# Altium schematic sheet Gate_Driver.SchDoc
size A4; CompanyName: I-MTEC; DrawnBy: R.R.Sorial; SheetNumber: 3; SheetTotal: 5
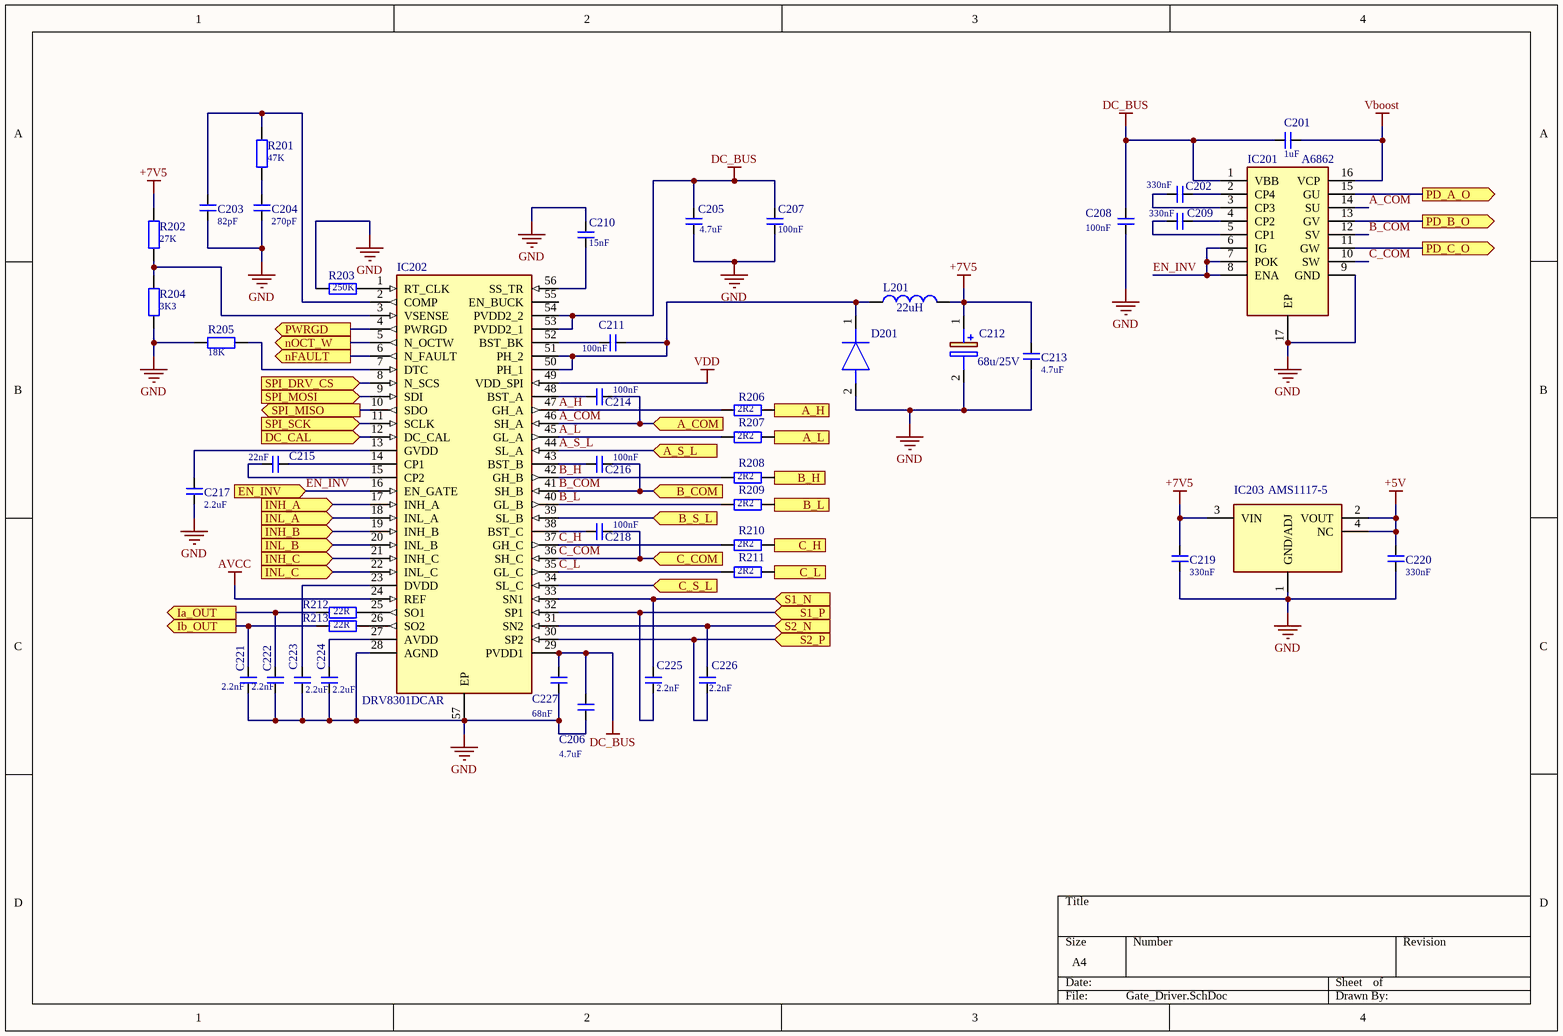
[diagram p0: Gate_Driver.SchDoc]

## Parts
C201  value 1uF  [CAPC1005X06N]  (hidden comment: Cap)
C202  value 330nF  [CAPC1005X06N]  (hidden comment: Cap)
C203  value 82pF  [CAPC1005X06N]  (hidden comment: Cap)
C204  value 270pF  [CAPC1005X06N]  (hidden comment: Cap)
C205  value 4.7uF  [CAPC3225X17N]  (hidden comment: Cap)
C206  value 4.7uF  [CAPC3225X17N]  (hidden comment: Cap)
C207  value 100nF  [CAPC1005X06N]  (hidden comment: Cap)
C208  value 100nF  [CAPC1005X06N]  (hidden comment: Cap)
C209  value 330nF  [CAPC1005X06N]  (hidden comment: Cap)
C210  value 15nF  [CAPC1005X06N]  (hidden comment: Cap)
C211  value 100nF  [CAPC1005X06N]  (hidden comment: Cap)
C212  68u/25V  [EEE0GA101SR]
C213  value 4.7uF  [CAPC3225X17N]  (hidden comment: Cap)
C214  value 100nF  [CAPC1005X06N]  (hidden comment: Cap)
C215  value 22nF  [CAPC1005X06N]  (hidden comment: Cap)
C216  value 100nF  [CAPC1005X06N]  (hidden comment: Cap)
C217  value 2.2uF  [CAPC1005X06N]  (hidden comment: Cap)
C218  value 100nF  [CAPC1005X06N]  (hidden comment: Cap)
C219  value 330nF  [CAPC1005X06N]  (hidden comment: Cap)
C220  value 330nF  [CAPC1005X06N]  (hidden comment: Cap)
C221  value 2.2nF  [CAPC1005X06N]  (hidden comment: Cap)
C222  value 2.2nF  [CAPC1005X06N]  (hidden comment: Cap)
C223  value 2.2uF  [CAPC1005X06N]  (hidden comment: Cap)
C224  value 2.2uF  [CAPC1005X06N]  (hidden comment: Cap)
C225  value 2.2nF  [CAPC1005X06N]  (hidden comment: Cap)
C226  value 2.2nF  [CAPC1005X06N]  (hidden comment: Cap)
C227  value 68nF  [CAPC1005X06N]  (hidden comment: Cap)
D201  MBR140SFT3G  [SODFL3616X98N]  (value not drawn)
IC201  A6862  [SOP65P640X120-17N]
IC202  DRV8301DCAR  [SOP50P810X120-57N]
IC203  AMS1117-5  [SOT229P700X180-4N]
L201  value 22uH  [INDP6060X30N]  (hidden comment: L)
R201  value 47K  [RESC1005X04N]  (hidden comment: R)
R202  value 27K  [RESC1005X04N]  (hidden comment: R)
R203  value 250K  [RESC2012X06N]  (hidden comment: R)
R204  value 3K3  [RESC1005X04N]  (hidden comment: R)
R205  value 18K  [RESC1005X04N]  (hidden comment: R)
R206  value 2R2  [RESC2012X06N]  (hidden comment: R)
R207  value 2R2  [RESC2012X06N]  (hidden comment: R)
R208  value 2R2  [RESC2012X06N]  (hidden comment: R)
R209  value 2R2  [RESC2012X06N]  (hidden comment: R)
R210  value 2R2  [RESC2012X06N]  (hidden comment: R)
R211  value 2R2  [RESC2012X06N]  (hidden comment: R)
R212  value 22R  [RESC1005X04N]  (hidden comment: R)
R213  value 22R  [RESC1005X04N]  (hidden comment: R)

## Ports
A_COM (in, see Main_CPU[7C], Inverter[1B]), A_H (out, see Main_CPU[7C], Inverter[1B]), A_L (out, see Main_CPU[7C], Inverter[1B]), A_S_L (in, see Main_CPU[7C], Inverter[1B]), B_COM (in, see Main_CPU[7C], Inverter[8C]), B_H (out, see Main_CPU[7C], Inverter[8B]), B_L (out, see Main_CPU[7C], Inverter[8C]), B_S_L (in, see Main_CPU[7C], Inverter[8B]), C_COM (in, see Main_CPU[7D], Inverter[5D]), C_H (out, see Main_CPU[7D], Inverter[5D]), C_L (out, see Main_CPU[7D], Inverter[5D]), C_S_L (in, see Main_CPU[7D], Inverter[4D]), DC_CAL (in, see Main_CPU[7C]), EN_INV (in, see Main_CPU[7C]), Ia_OUT (out, see Main_CPU[7D]), Ib_OUT (out, see Main_CPU[7D]), INH_A (in, see Main_CPU[7C]), INH_B (in, see Main_CPU[7C]), INH_C (in, see Main_CPU[7C]), INL_A (in, see Main_CPU[7C]), INL_B (in, see Main_CPU[7C]), INL_C (in, see Main_CPU[7C]), nFAULT (out, see Main_CPU[7D]), nOCT_W (out, see Main_CPU[7D]), PD_A_O (out, see Main_CPU[7C]), PD_B_O (out, see Main_CPU[7C]), PD_C_O (out, see Main_CPU[7C]), PWRGD (out, see Main_CPU[7D]), S1_N (in, see Main_CPU[7D], Inverter[1B]), S1_P (in, see Main_CPU[7D], Inverter[1B]), S2_N (in, see Main_CPU[7D]), S2_P (in, see Main_CPU[7D]), SPI_DRV_CS (in, see Main_CPU[7C]), SPI_MISO (out, see Main_CPU[7C]), SPI_MOSI (in, see Main_CPU[7C]), SPI_SCK (in, see Main_CPU[7C])

## Nets
+5V: C220.1 IC203.2(VOUT) IC203.4(NC)
+7V5: C212.1(+) C213.2 C219.1 IC203.3(VIN) L201.2 R202.1
AVCC: IC202.24(REF)
DC_BUS: C201.2 C205.2 C206.2 C207.1 C208.2 C227.2 IC201.1(VBB) IC202.29(PVDD1) IC202.53(PVDD2_1) IC202.54(PVDD2_2)
GND: C203.1 C204.1 C205.1 C206.1 C207.2 C208.1 C210.1 C212.2(-) C213.1 C217.1 C219.2 C220.2 C221.1 C222.1 C223.1 C224.1 C227.1 D201.2(A) IC201.9(GND) IC201.17(EP) IC202.28(AGND) IC202.57(EP) IC203.1(GND/ADJ) R203.2 R204.1 R205.2
Vboost: C201.1 IC201.16(VCP)
VDD: IC202.49(VDD_SPI)
A_COM: C214.1 IC201.14(SU) IC202.46(SH_A) ; port A_COM
A_H: IC202.47(GH_A) R206.2
A_H: R206.1 ; port A_H  [a separate net that carries the same name]
A_L: IC202.45(GL_A) R207.2
A_L: R207.1 ; port A_L  [a separate net that carries the same name]
A_S_L: IC202.44(SL_A) ; port A_S_L
B_COM: C216.1 IC201.12(SV) IC202.41(SH_B) ; port B_COM
B_H: IC202.42(GH_B) R208.2
B_H: R208.1 ; port B_H  [a separate net that carries the same name]
B_L: IC202.40(GL_B) R209.2
B_L: R209.1 ; port B_L  [a separate net that carries the same name]
B_S_L: IC202.39(SL_B) ; port B_S_L
C_COM: C218.1 IC201.10(SW) IC202.36(SH_C) ; port C_COM
C_H: IC202.37(GH_C) R210.2
C_H: R210.1 ; port C_H  [a separate net that carries the same name]
C_L: IC202.35(GL_C) R211.2
C_L: R211.1 ; port C_L  [a separate net that carries the same name]
C_S_L: IC202.34(SL_C) ; port C_S_L
DC_CAL: IC202.12(DC_CAL) ; port DC_CAL
EN_INV: IC201.6(IG) IC201.7(POK) IC201.8(ENA) IC202.16(EN_GATE) ; port EN_INV
Ia_OUT: C222.2 R212.2 ; port Ia_OUT
Ib_OUT: C221.2 R213.2 ; port Ib_OUT
INH_A: IC202.17(INH_A) ; port INH_A
INH_B: IC202.19(INH_B) ; port INH_B
INH_C: IC202.21(INH_C) ; port INH_C
INL_A: IC202.18(INL_A) ; port INL_A
INL_B: IC202.20(INL_B) ; port INL_B
INL_C: IC202.22(INL_C) ; port INL_C
nFAULT: IC202.6(N_FAULT) ; port nFAULT
nOCT_W: IC202.5(N_OCTW) ; port nOCT_W
PD_A_O: IC201.15(GU) ; port PD_A_O
PD_B_O: IC201.13(GV) ; port PD_B_O
PD_C_O: IC201.11(GW) ; port PD_C_O
PWRGD: IC202.4(PWRGD) ; port PWRGD
S1_N: C225.2 IC202.33(SN1) ; port S1_N
S1_P: C225.1 IC202.32(SP1) ; port S1_P
S2_N: C226.2 IC202.31(SN2) ; port S2_N
S2_P: C226.1 IC202.30(SP2) ; port S2_P
SPI_DRV_CS: IC202.8(N_SCS) ; port SPI_DRV_CS
SPI_MISO: IC202.10(SDO) ; port SPI_MISO
SPI_MOSI: IC202.9(SDI) ; port SPI_MOSI
SPI_SCK: IC202.11(SCLK) ; port SPI_SCK
NetC202_1: C202.1 IC201.2(CP4)
NetC202_2: C202.2 IC201.3(CP3)
NetC203_2: C203.2 IC202.2(COMP) R201.2
NetC204_2: C204.2 R201.1
NetC209_1: C209.1 IC201.4(CP2)
NetC209_2: C209.2 IC201.5(CP1)
NetC210_2: C210.2 IC202.56(SS_TR)
NetC211_1: C211.1 D201.1(K) IC202.50(PH_1) IC202.51(PH_2) L201.1
NetC211_2: C211.2 IC202.52(BST_BK)
NetC214_2: C214.2 IC202.48(BST_A)
NetC215_1: C215.1 IC202.14(CP1)
NetC215_2: C215.2 IC202.15(CP2)
NetC216_2: C216.2 IC202.43(BST_B)
NetC217_2: C217.2 IC202.13(GVDD)
NetC218_2: C218.2 IC202.38(BST_C)
NetC223_2: C223.2 IC202.23(DVDD)
NetC224_2: C224.2 IC202.27(AVDD)
NetIC202_1: IC202.1(RT_CLK) R203.1
NetIC202_3: IC202.3(VSENSE) R202.2 R204.2
NetIC202_7: IC202.7(DTC) R205.1
NetIC202_25: IC202.25(SO1) R212.1
NetIC202_26: IC202.26(SO2) R213.1

Not connected (* = marked no-connect by the designer): IC202 55(EN_BUCK)

## Library data of the parts
C201 = Cap: Capacitor; MPN: GRM155Z71A105KE01D; Link: https://jlcpcb.com/partdetail/548880-GRM155Z71A105KE01D/C528974; Price: 0.0206
C202 C209 C219 C220 = Cap: Capacitor; MPN: 0402B334K160NT; Link: https://jlcpcb.com/partdetail/287763-0402B334K160NT/C301942; Price: 0.015
C203 = Cap: Capacitor; MPN: CC0402JRNPO9BN820; Link: https://jlcpcb.com/partdetail/Yageo-CC0402JRNPO9BN820/C107011; Price: 0.001
C204 = Cap: Capacitor; MPN: CC0402KRX7R9BB271; Link: https://jlcpcb.com/partdetail/Yageo-CC0402KRX7R9BB271/C107027; Price: 0.001
C205 C206 C213 = Cap: Capacitor; MPN: CC1210KKX7R8BB475; Link: https://www.lcsc.com/product-detail/Multilayer-Ceramic-Capacitors-MLCC-SMD-SMT_YAGEO-CC1210KKX7R8BB475_C2980104.html; Price: 0.1519
C207 C208 C211 C214 C216 C218 = Cap: Capacitor; MPN: GCM155R71H104KE02D; Link: https://jlcpcb.com/partdetail/MurataElectronics-GCM155R71H104KE02D/C85858; Price: 0.0031
C210 = Cap: Capacitor; MPN: GRM155R71E153KA61D; Link: https://jlcpcb.com/partdetail/MurataElectronics-GRM155R71E153KA61D/C97869; Price: 0.0043
C212 = EEE-FT1E680AR: Capacitor Polarised; Manufacturer_Name: Panasonic; Datasheet Link: http://industrial.panasonic.com/cdbs/www-data/pdf/RDE0000/ABA0000C1240.pdf; Height: 6.5mm; MPN: EEE-FT1E680AR; Mouser Part Number: 667-EEE-FT1E680AR; Mouser Price/Stock: https://www.mouser.co.uk/ProductDetail/Panasonic/EEE-FT1E680AR?qs=CMJjuEs1%252BuEkcyWhjLG4NQ%3D%3D; Link: https://www.lcsc.com/product-detail/Aluminum-Electrolytic-Capacitors-SMD_PANASONIC-EEEFT1E680AR_C178592.html; Price: 0.1901
C215 = Cap: Capacitor; MPN: CC0603JRX7R8BB223; Link: https://www.lcsc.com/product-detail/Multilayer-Ceramic-Capacitors-MLCC-SMD-SMT_YAGEO-CC0603JRX7R8BB223_C327290.html; Price: 0.008
C217 C223 C224 = Cap: Capacitor; MPN: GRM155Z71A225KE44D; Link: https://jlcpcb.com/partdetail/3478404-GRM155Z71A225KE44D/C2999759; Price: 0.0332
C221 C222 C225 C226 = Cap: Capacitor; MPN: CC0402KRX7R7BB222; Link: https://jlcpcb.com/partdetail/Yageo-CC0402KRX7R7BB222/C541376; Price: 0.001
C227 = Cap: Capacitor; MPN: GCM155R71C683KA55D; Link: https://jlcpcb.com/partdetail/172547-GCM155R71C683KA55D/C161166; Price: 0.0075
D201 = MBR140SFT3G: Diode; Manufacturer_Name: onsemi; MPN: LMBR140FT1G; Datasheet Link: https://componentsearchengine.com/Datasheets/2/MBR140SFT3G.pdf; Height: 0.98mm; Manufacturer_Part_Number: MBR140SFT3G; Mouser Price/Stock: https://www.mouser.co.uk/ProductDetail/onsemi/MBR140SFT3G?qs=3JMERSakebocVlQyvh5H6Q%3D%3D; Arrow Part Number: MBR140SFT3G; Arrow Price/Stock: https://www.arrow.com/en/products/mbr140sft3g/on-semiconductor?region=nac; Link: https://www.lcsc.com/product-detail/Schottky-Diodes_LRC-LMBR140FT1G_C131782.html; Price: 0.0234
IC201 = A6861-A6862: Integrated Circuit; Manufacturer_Name: Allegro Microsystems; MPN: A6862KLPTR-T; Datasheet Link: https://www.allegromicro.com/-/media/files/datasheets/a6862-datasheet.pdf; Height: 1.2mm; Link: https://www.lcsc.com/product-detail/Gate-Drivers_Allegro-MicroSystems-LLC-A6862KLPTR-T_C2677085.html; Price: 2.8803
IC202 = DRV8301DCAR: Integrated Circuit; Manufacturer_Name: Texas Instruments; Datasheet Link: http://www.ti.com/lit/gpn/drv8301; Height: 1.2mm; Mouser Part Number: 595-DRV8301DCAR; Mouser Price/Stock: https://www.mouser.co.uk/ProductDetail/Texas-Instruments/DRV8301DCAR?qs=SMj%252Bbyv09TwYHebRFanjcw%3D%3D; Arrow Part Number: DRV8301DCAR; Arrow Price/Stock: null?region=nac; MPN: DRV8301DCAR; Link: https://jlcpcb.com/partdetail/TexasInstruments-DRV8301DCAR/C98969; Price: 2.4675
IC203 = AMS1117-3.3: Integrated Circuit; Manufacturer_Name: Advanced; MPN: LM1117IMPX-5.0/NOPB; Datasheet Link: https://datasheet.datasheetarchive.com/originals/distributors/Datasheets-28/DSA-550594.pdf; Height: 1.8mm; Link: https://www.lcsc.com/product-detail/Voltage-Regulators-Linear-Low-Drop-Out-LDO-Regulators_Texas-Instruments-LM1117IMPX-5-0-NOPB_C41202.html?s_z=n_LM1117; Price: 0.31
L201 = L: MPN: XRNR6028-22uH/M; Link: https://www.lcsc.com/product-detail/Power-Inductors_XR-XRNR6028-22uH-M_C5339730.html; Price: 0.0521
R201 = R: Resistor; MPN: RC0402FR-0747KL; Link: https://jlcpcb.com/partdetail/Yageo-RC0402FR0747KL/C93943; Price: 0.0006
R202 = R: Resistor; MPN: RC0402FR-0727KL; Link: https://jlcpcb.com/partdetail/Yageo-RC0402FR0727KL/C138022; Price: 0.0006
R203 = R: Resistor; MPN: ARG05FTC2503N; Link: https://www.lcsc.com/product-detail/Chip-Resistor-Surface-Mount_Viking-Tech-ARG05FTC2503N_C5156563.html; Price: 0.0081
R204 = R: Resistor; MPN: RC0402FR-073K3L; Link: https://jlcpcb.com/partdetail/Yageo-RC0402FR073K3L/C137992; Price: 0.0006
R205 = R: Resistor; MPN: RC0402FR-0718KL; Link: https://jlcpcb.com/partdetail/Yageo-RC0402FR0718KL/C138044; Price: 0.0006
R206-R211 = R: Resistor; MPN: RC0402FR-072R2L; Link: https://www.lcsc.com/product-detail/Chip-Resistor-Surface-Mount_YAGEO-RC0402FR-072R2L_C327251.html; Price: 0.0016
R212 R213 = R: Resistor; MPN: RC0402FR-0722RL; Link: https://jlcpcb.com/partdetail/Yageo-RC0402FR0722RL/C114765; Price: 0.0006